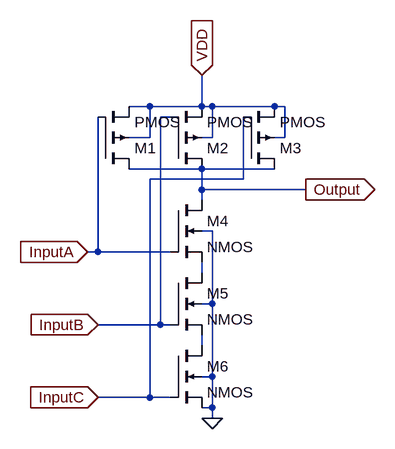
[diagram p0: schematic NAND3.asc]
NAND3.asc, the LTspice schematic file:
Version 4.1
SHEET 1 940 680
WIRE 560 0 528 0
WIRE 640 0 640 -48
WIRE 640 0 560 0
WIRE 656 0 640 0
WIRE 752 0 656 0
WIRE 768 0 752 0
WIRE 592 16 576 16
WIRE 560 48 560 0
WIRE 560 48 528 48
WIRE 656 48 656 0
WIRE 656 48 640 48
WIRE 768 48 768 0
WIRE 768 48 752 48
WIRE 640 96 528 96
WIRE 752 96 640 96
WIRE 704 112 704 16
WIRE 704 112 560 112
WIRE 640 128 640 96
WIRE 800 128 640 128
WIRE 640 144 640 128
WIRE 656 192 640 192
WIRE 480 224 480 16
WIRE 480 224 464 224
WIRE 592 224 480 224
WIRE 640 256 640 240
WIRE 656 304 656 192
WIRE 656 304 640 304
WIRE 576 336 576 16
WIRE 576 336 480 336
WIRE 592 336 576 336
WIRE 640 368 640 352
WIRE 656 416 656 304
WIRE 656 416 640 416
WIRE 560 448 560 112
WIRE 560 448 480 448
WIRE 592 448 560 448
WIRE 656 464 656 416
WIRE 656 464 640 464
WIRE 656 480 656 464
FLAG 656 480 0
FLAG 640 -48 VDD
IOPIN 640 -48 In
FLAG 800 128 Output
IOPIN 800 128 Out
FLAG 464 224 InputA
IOPIN 464 224 In
FLAG 480 336 InputB
IOPIN 480 336 In
FLAG 480 448 InputC
IOPIN 480 448 In
SYMBOL pmos4 480 96 M180
SYMATTR InstName M1
SYMATTR Value2 l=1 w=4
SYMBOL pmos4 592 96 M180
SYMATTR InstName M2
SYMATTR Value2 l=1 w=4
SYMBOL pmos4 704 96 M180
SYMATTR InstName M3
SYMATTR Value2 l=1 w=4
SYMBOL nmos4 592 144 R0
SYMATTR InstName M4
SYMATTR Value2 l=1 w=2
SYMBOL nmos4 592 256 R0
SYMATTR InstName M5
SYMATTR Value2 l=1 w=2
SYMBOL nmos4 592 368 R0
SYMATTR InstName M6
SYMATTR Value2 l=1 w=2

The netlist it stands for:
* NAND3.asc
M1 Output InputA VDD VDD PMOS l=1 w=4
M2 Output InputB VDD VDD PMOS l=1 w=4
M3 Output InputC VDD VDD PMOS l=1 w=4
M4 Output InputA N001 0 NMOS l=1 w=2
M5 N001 InputB N002 0 NMOS l=1 w=2
M6 N002 InputC 0 0 NMOS l=1 w=2
.model NMOS NMOS
.model PMOS PMOS
.lib standard.mos
.backanno
.end